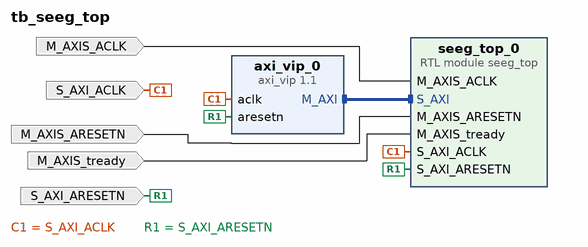
[diagram p0: block diagram of the top level]
# Vivado block design tb_seeg_top, xck26-sfvc784-2LV-c, Vivado 2023.1
create_bd_design tb_seeg_top

create_bd_port -dir I -type rst M_AXIS_ARESETN
create_bd_port -dir I -type rst S_AXI_ARESETN
create_bd_port -dir I -type clk S_AXI_ACLK
set_property -dict {CONFIG.FREQ_HZ 39000000} [get_bd_ports S_AXI_ACLK]
create_bd_port -dir I -type clk M_AXIS_ACLK
set_property -dict {CONFIG.FREQ_HZ 250000000} [get_bd_ports M_AXIS_ACLK]
create_bd_port -dir I M_AXIS_tready

create_bd_cell -type ip -vlnv xilinx.com:ip:axi_vip:1.1 axi_vip_0
set_property -dict [list \
  CONFIG.ADDR_WIDTH 32 \
  CONFIG.DATA_WIDTH 32 \
  CONFIG.HAS_BRESP 1 \
  CONFIG.HAS_PROT 1 \
  CONFIG.HAS_RRESP 1 \
  CONFIG.HAS_WSTRB 1 \
  CONFIG.INTERFACE_MODE MASTER \
  CONFIG.PROTOCOL AXI4LITE \
  CONFIG.READ_WRITE_MODE READ_WRITE \
] [get_bd_cells axi_vip_0]
create_bd_cell -type module -reference seeg_top seeg_top_0

# ---- connections ----

connect_bd_intf_net [get_bd_intf_pins axi_vip_0/M_AXI] [get_bd_intf_pins seeg_top_0/S_AXI]
connect_bd_net [get_bd_ports M_AXIS_ACLK] [get_bd_pins seeg_top_0/M_AXIS_ACLK]
connect_bd_net [get_bd_ports M_AXIS_ARESETN] [get_bd_pins seeg_top_0/M_AXIS_ARESETN]
connect_bd_net [get_bd_ports M_AXIS_tready] [get_bd_pins seeg_top_0/M_AXIS_tready]
connect_bd_net [get_bd_ports S_AXI_ACLK] [get_bd_pins axi_vip_0/aclk] [get_bd_pins seeg_top_0/S_AXI_ACLK]
connect_bd_net [get_bd_ports S_AXI_ARESETN] [get_bd_pins axi_vip_0/aresetn] [get_bd_pins seeg_top_0/S_AXI_ARESETN]

validate_bd_design
save_bd_design
